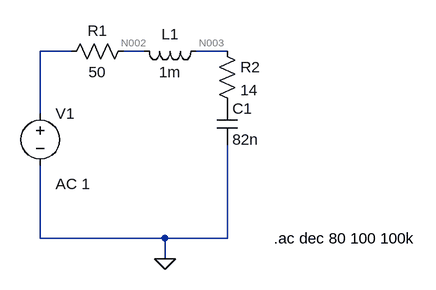
[diagram p0: schematic 2_2.asc]
2_2.asc, the LTspice schematic file:
Version 4.1
SHEET 1 880 680
WIRE 96 48 48 48
WIRE 208 48 176 48
WIRE 336 48 288 48
WIRE 48 144 48 48
WIRE 48 336 48 224
WIRE 240 336 48 336
WIRE 336 336 336 192
WIRE 336 336 240 336
WIRE 240 368 240 336
FLAG 240 368 0
SYMBOL voltage 48 128 R0
WINDOW 123 24 124 Left 2
WINDOW 39 0 0 Left 0
SYMATTR Value2 AC 1
SYMATTR InstName V1
SYMATTR Value ""
SYMBOL res 192 32 R90
WINDOW 0 0 56 VBottom 2
WINDOW 3 32 56 VTop 2
SYMATTR InstName R1
SYMATTR Value 50
SYMBOL ind 304 32 R90
WINDOW 0 5 56 VBottom 2
WINDOW 3 32 56 VTop 2
SYMATTR InstName L1
SYMATTR Value 1m
SYMATTR SpiceLine Rser=1m
SYMBOL cap 320 128 R0
SYMATTR InstName C1
SYMATTR Value 82n
SYMBOL res 320 32 R0
SYMATTR InstName R2
SYMATTR Value 14
TEXT 408 336 Left 2 !.ac dec 80 100 100k

The netlist it stands for:
* 2_2.asc
V1 N001 0 AC 1
R1 N002 N001 50
L1 N003 N002 1m Rser=1m
C1 P001 0 82n
R2 N003 P001 14
.ac dec 80 100 100k
.backanno
.end

* Results of the author's LTspice run, read from the files saved beside the schematic
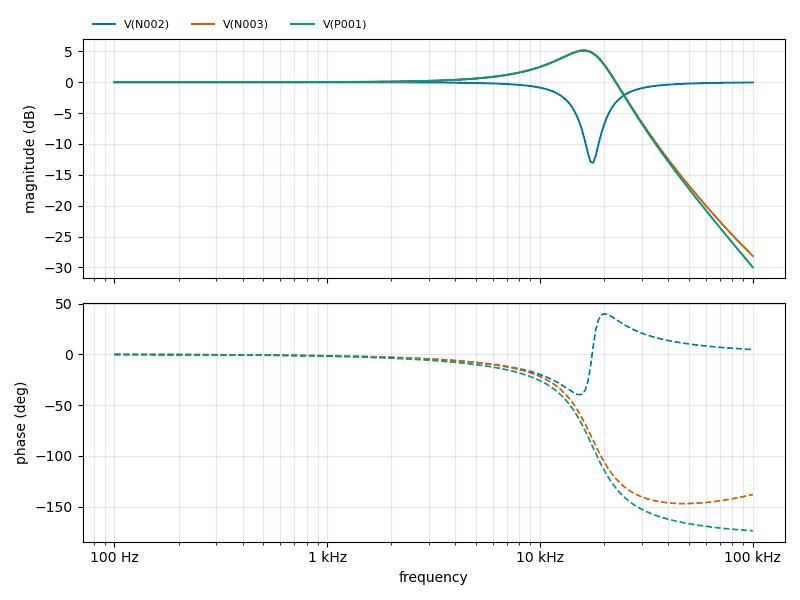
[diagram p1: AC Analysis of 2_2.asc, plotted from the saved traces]
* AC Analysis, 1 run:
*   V(N002): -0.00 dB at 100 Hz, -0.05 dB at 100 kHz, peak -0.00 dB at 100 Hz, 3 dB below the peak at 13.38 kHz
*   V(N003): 0.00 dB at 100 Hz, -28.16 dB at 100 kHz, peak 5.17 dB at 15.85 kHz, 3 dB below the peak at 9.322 kHz and 20.74 kHz
*   V(P001): 0.00 dB at 100 Hz, -29.98 dB at 100 kHz, peak 5.11 dB at 15.85 kHz, 3 dB below the peak at 9.244 kHz and 20.7 kHz